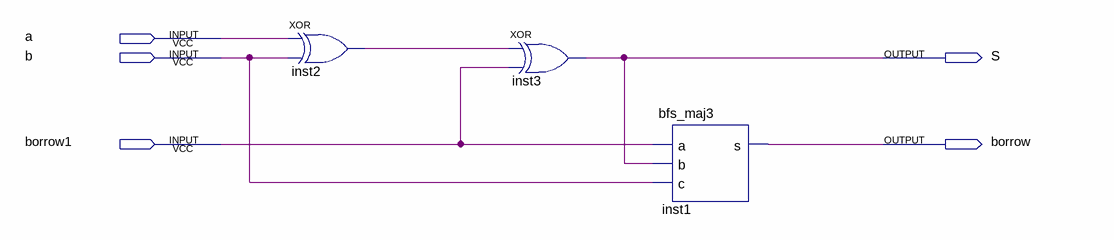
[diagram p0: schematic sheet]
// Quartus schematic bfs_fs.bdf as structural Verilog: 3 symbols, 5 pins
module bfs_fs (
  input  a,
  input  b,
  input  borrow1,
  output S,
  output borrow
);

  wire inst2_out;

  xor inst2 (inst2_out, a, b);
  xor inst3 (S, inst2_out, borrow1);
  bfs_maj3 inst1 (.a(borrow1), .b(S), .c(b), .s(borrow));
endmodule
